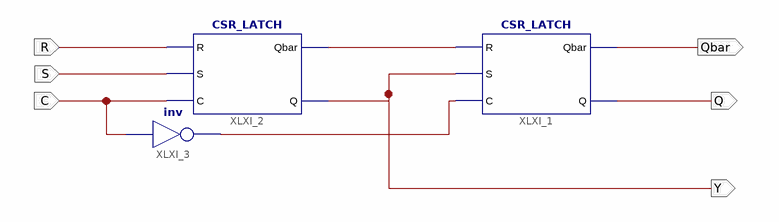
[diagram p0: schematic sheet 1]
// Xilinx ISE schematic MS_FLIPFLOP.sch (kintex7) as structural Verilog: 3 symbols, 6 ports
module MS_FLIPFLOP (
  input  S,
  input  R,
  input  C,
  output Y,
  output Q,
  output Qbar
);

  wire XLXN_5, XLXN_7;

  CSR_LATCH XLXI_1 (.R(XLXN_5), .S(Y), .C(XLXN_7), .Qbar(Qbar), .Q(Q));
  CSR_LATCH XLXI_2 (.R(R), .S(S), .C(C), .Qbar(XLXN_5), .Q(Y));
  not XLXI_3 (XLXN_7, C);
endmodule
